# Altium schematic sheet D143.01A01-V9821S.SchDoc
size A2
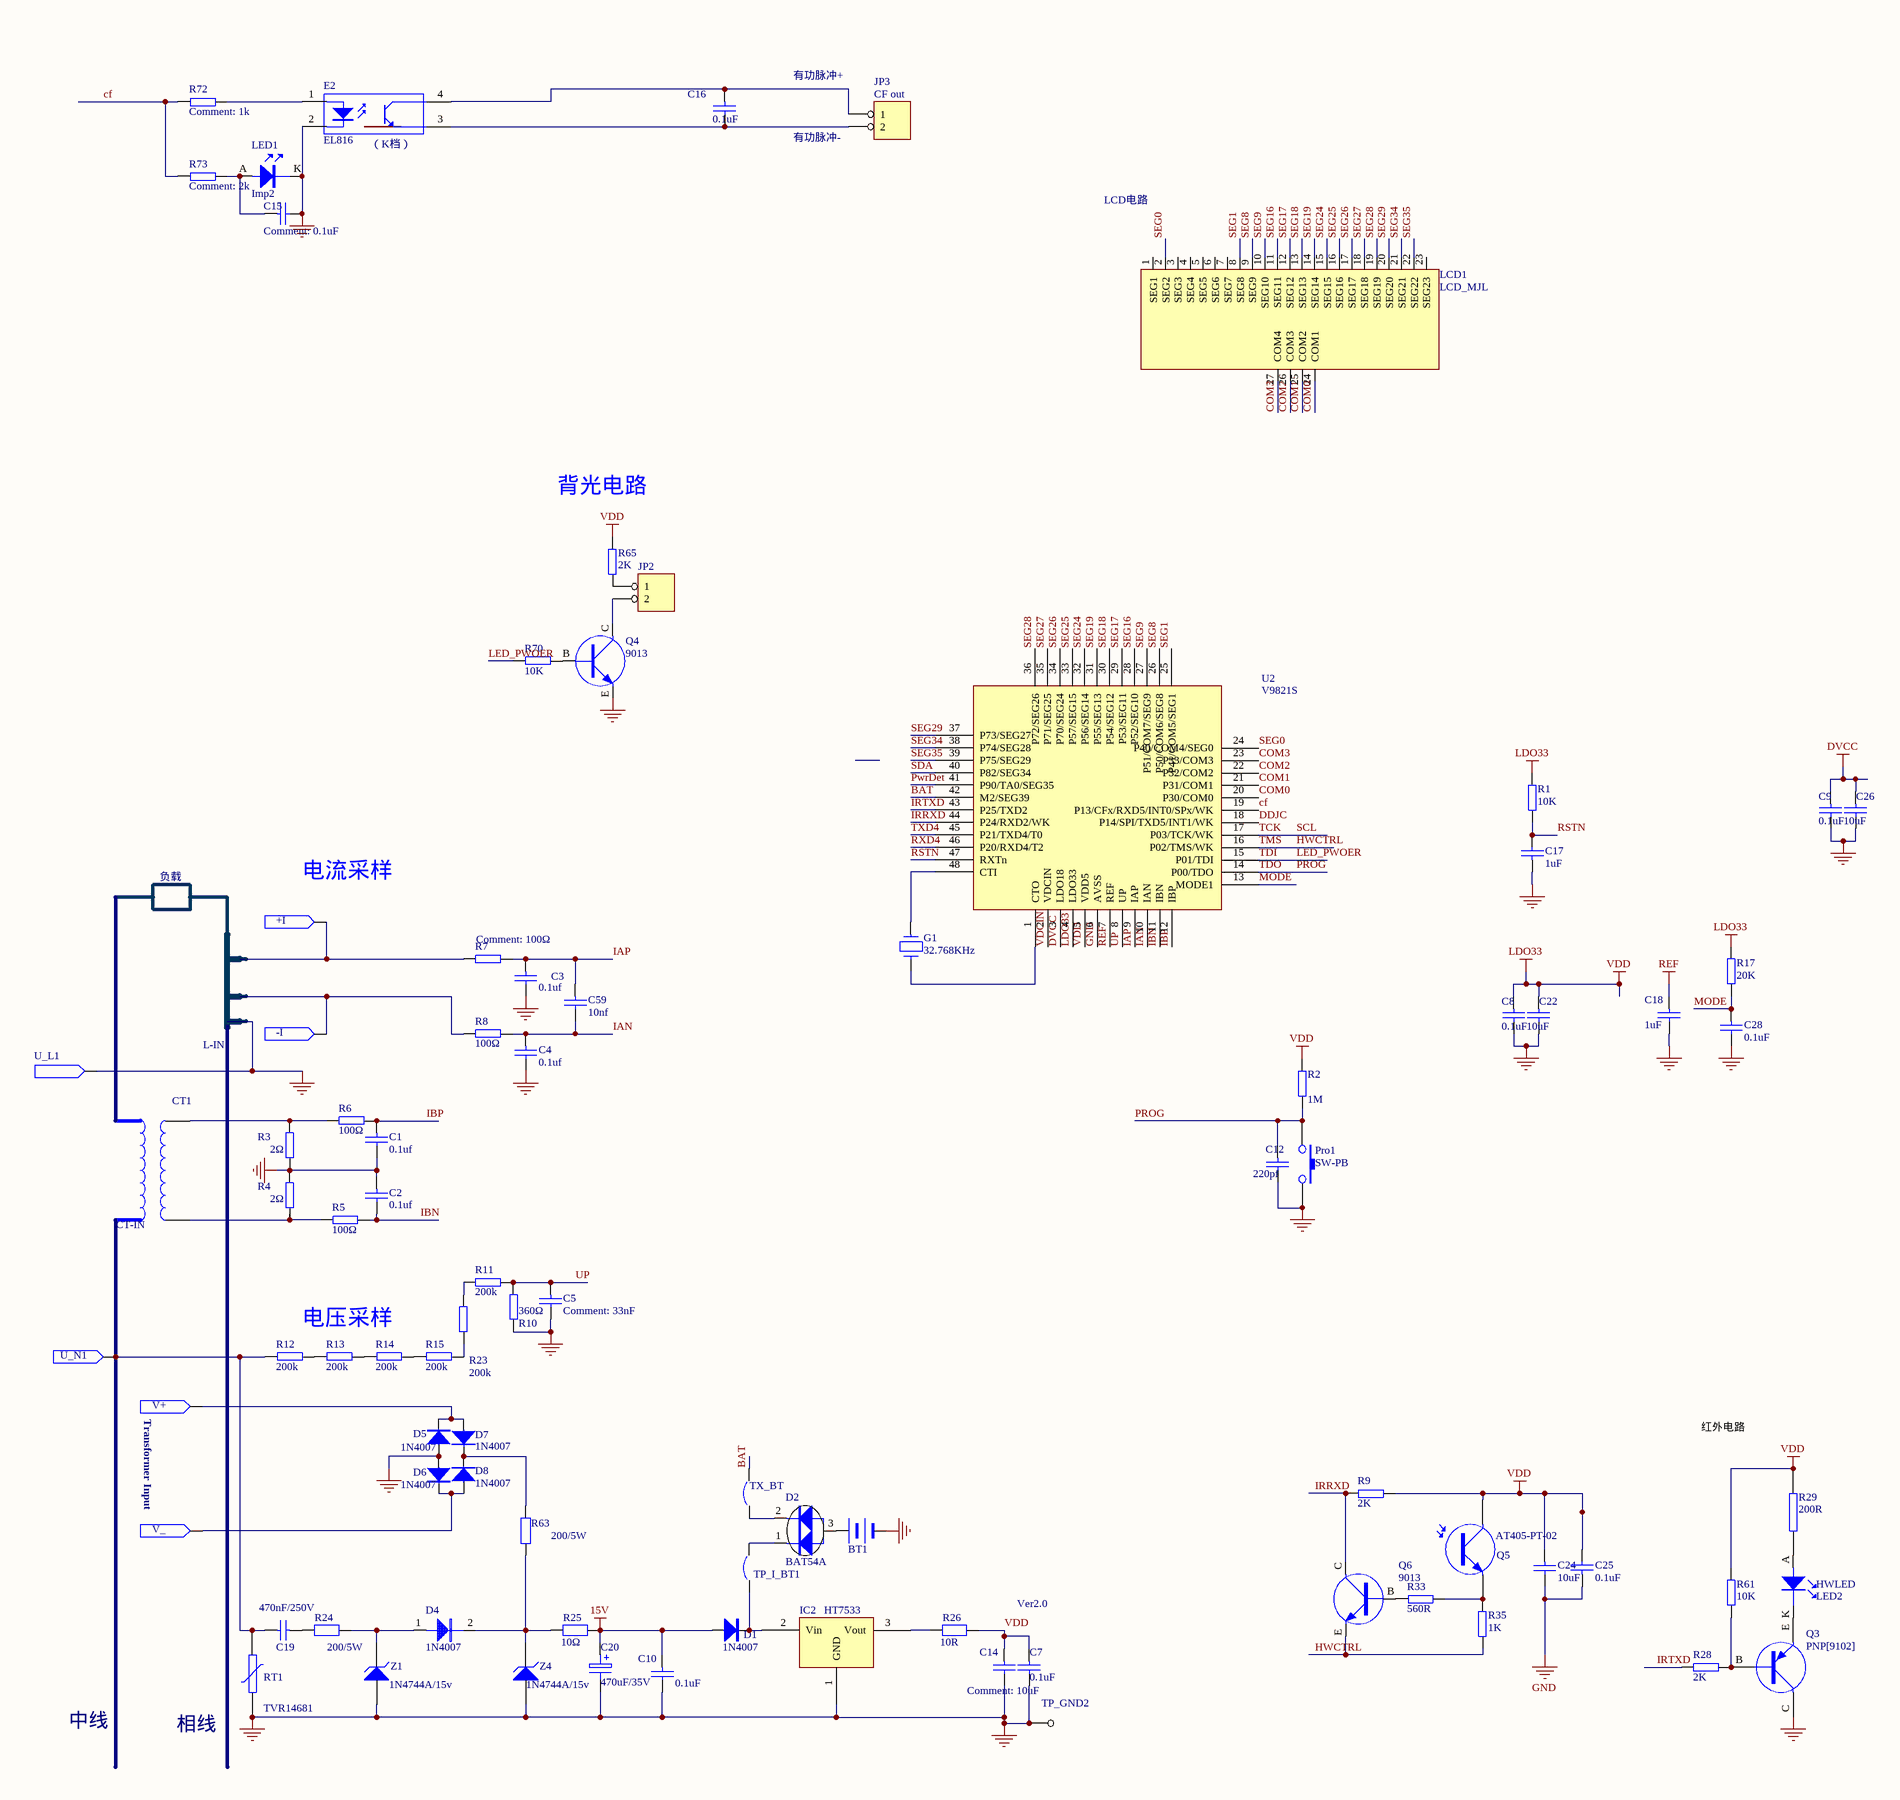
[diagram p0: D143.01A01-V9821S.SchDoc, left]
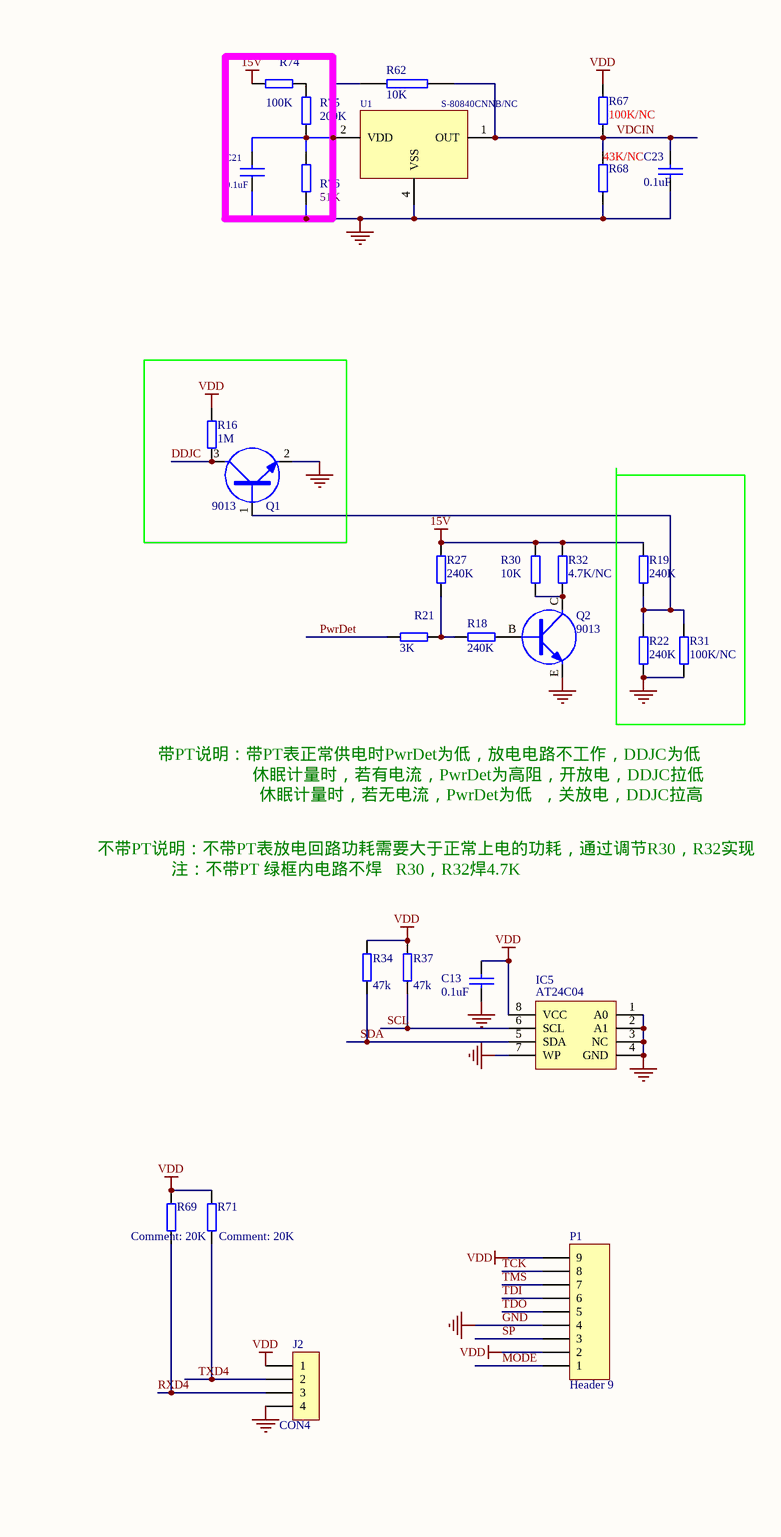
[diagram p1: D143.01A01-V9821S.SchDoc, right]

## Parts
+I  (no value)  [PAD]
-I  (no value)  [PAD]
BT1  BT1  [BAT]  (value not drawn)
C1  0.1uf  [0603C]
C2  0.1uf  [0603C]
C3  0.1uf  [0603C]
C4  0.1uf  [0603C]
C5  33nF  [0603C]
C7  0.1uF  [0603C]
C8  0.1uF  [0603C]
C9  0.1uF  [0603C]
C10  0.1uF  [0603C]
C12  220pf  [0603C]
C13  0.1uF  [0603C]
C14  10uF  [0805C]
C15  0.1uF  [0603C]
C16  0.1uF  [0603C]
C17  1uF  [0603C]
C18  1uF  [0805C]
C19  470nF/250V  [CAP0.47UF/250V]
C20  470uF/35V  [RB.2/.4]
C21  0.1uF  [0603C]
C22  10uF  [0805C]
C23  0.1uF  [0603C]
C24  10uF  [0805c]
C25  0.1uF  [0603C]
C26  10uF  [0805C]
C28  0.1uF  [0603C]
C59  10nf  [0603C]
CT1  CT-IN  [CT]
D1  1N4007  [MLL41]
D2  BAT54A  [SOT_23]
D4  1N4007  [DIODE-L]
D5  1N4007  [MLL41]
D6  1N4007  [MLL41]
D7  1N4007  [MLL41]
D8  1N4007  [MLL41]
E2  EL816  [SOP-4]
G1  32.768KHz  [OSC]
IC2  HT7533  [SOT-89]
IC5  AT24C04  [SOP8]
J2  CON4  [SIP4]
JP2  (no value)  [SIP2]
JP3  CF out  [ct]
LCD1  LCD_MJL  [LCD_MJL]
LED1  Imp2  [LED]
LED2  HWLED  [LED]
P1  Header 9  [CONNECT1]
Pro1  SW-PB  [KEY1]
Q1  9013  [SOT-23]
Q2  9013  [SOT-23-EBC]
Q3  PNP[9102]  [SOT-23-EBC]
Q4  9013  [SOT-23-EBC]
Q5  AT405-PT-02  [LED2]
Q6  9013  [SOT-23-EBC]
R1  10K  [0603R]
R2  1M  [0603R]
R3  2Ω  [0805R]
R4  2Ω  [0805R]
R5  100Ω  [0603R]
R6  100Ω  [0603R]
R7  100Ω  [0603R]
R8  100Ω  [0603R]
R9  2K  [0603R]
R10  360Ω  [0805R]
R11  200k  [0805R]
R12  200k  [0805R]
R13  200k  [0805R]
R14  200k  [0805R]
R15  200k  [0805R]
R16  1M  [0603R]
R17  20K  [0603R]
R18  240K  [0603R]
R19  240K  [0603R]
R21  3K  [0603R]
R22  240K  [0603R]
R23  200k  [0805R]
R24  200/5W  [AXIAL0.8A]
R25  10Ω  [0805R]
R26  10R  [0805R]
R27  240K  [0603R]
R28  2K  [0603R]
R29  200R  [0603R]
R30  10K  [0603R]
R31  100K/NC  [0603R]
R32  4.7K/NC  [0603R]
R33  560R  [0603R]
R34  47k  [0603R]
R35  1K  [0603R]
R37  47k  [0603R]
R61  10K  [0603R]
R62  10K  [0603R]
R63  200/5W  [AXIAL0.8A]
R65  2K  [0603R]
R67  100K/NC  [0603R]
R68  43K/NC  [0603R]
R69  20K  [0603R]
R70  10K  [0603R]
R71  20K  [0603R]
R72  1k  [0603R]
R73  2k  [0603R]
R74  100K  [0805R]
R75  200K  [0805R]
R76  51K  [0805R]
RT1  TVR14681  [YM20K681]
TP_GND2  TP  [TEST0]  (value not drawn)
TP_I_BT1  CIRCUIT BREAKER  [JUMP]  (value not drawn)
TX_BT  CIRCUIT BREAKER  [JUMP]  (value not drawn)
U1  S-80840CNNB/NC  [SC-82AB]
U2  V9821S
U_L1  (no value)  [PAD]
U_N1  (no value)  [PAD]
V+  (no value)  [PAD]
V_  (no value)  [PAD]
Z1  1N4744A/15v  [DIODE]
Z4  1N4744A/15v  [DIODE]

## Nets
15V: C10.1 C20.1 D1.1(A) R19.1 R25.1 R27.1 R30.2 R32.2 R74.2
DVCC: C9.1 C26.1 U2.3(LDO18)
GND: BT1.2(-) C1.2 C2.1 C3.2 C4.2 C5.2 C7.2 C8.2 C9.2 C10.2 C12.2 C13.2 C14.2 C15.2 C17.1 C18.2 C20.2 C21.1 C22.2 C23.2 C24.2 C25.1 C26.2 C28.2 D5.1(A) D6.1(A) E2.2 IC2.1(GND) IC5.1(A0) IC5.2(A1) IC5.3(NC) IC5.4(GND) IC5.7(WP) J2.4 LED1.K P1.4 Pro1.2 Pro1.4 Q1.2(E) Q2.E Q3.C Q4.E R3.2 R4.1 R10.2 R22.2 R31.1 R68.1 R76.1 RT1.2 TP_GND2.0 U1.4(VSS) U2.6(AVSS) U_L1.1 Z1.1(A) Z4.1(A)
LDO33: C7.1 C8.1 C13.1 C14.1 C22.1 C24.1 C25.2 IC5.8(VCC) J2.1 P1.2 P1.9 Q5.A(C) R1.2 R2.2 R9.2 R16.2 R17.1 R26.1 R29.2 R34.2 R37.2 R61.1 R65.2 R67.2 R69.1 R71.1 U2.4(LDO33) U2.5(VDD5)  [also labelled VDD]
NC: U1.3(NC)
REF: C18.1 U2.7(REF)
BAT: TX_BT.2 U2.42(M2/SEG39)
cf: R72.1 R73.1 U2.19(P13/CFx/RXD5/INT0/SPx/WK)
COM0: LCD1.24(COM1) U2.20(P30/COM0)
COM1: LCD1.25(COM2) U2.21(P31/COM1)
COM2: LCD1.26(COM3) U2.22(P32/COM2)
COM3: LCD1.27(COM4) U2.23(P33/COM3)
DDJC: Q1.3(C) R16.1 U2.18(P14/SPI/TXD5/INT1/WK)
HWCTRL: P1.7 Q6.E R35.1 U2.16(P02/TMS/WK)  [also labelled TMS]
IAN: C4.1 C59.2 R8.1 U2.10(IAN)
IAP: C3.1 C59.1 R7.1 U2.9(IAP)
IBN: C2.2 R5.1 U2.11(IBN)
IBP: C1.1 R6.1 U2.12(IBP)
IRRXD: Q6.C R9.1 U2.44(P24/RXD2/WK)
IRTXD: R28.2 U2.43(P25/TXD2)
LED_PWOER: P1.6 R70.2 U2.15(P01/TDI)  [also labelled TDI]
MODE: C28.1 P1.1 R17.2 U2.13(MODE1)
PROG: C12.1 P1.5 Pro1.1 Pro1.3 R2.1 U2.14(P00/TDO)  [also labelled TDO]
PwrDet: R21.1 U2.41(P90/TA0/SEG35)
RSTN: C17.2 R1.1 U2.47(RXTn)
RXD4: J2.3 R69.2 U2.46(P20/RXD4/T2)
SCL: IC5.6(SCL) P1.8 R37.1 U2.17(P03/TCK/WK)  [also labelled TCK]
SDA: IC5.5(SDA) R34.1 U2.40(P82/SEG34)
SEG0: LCD1.2(SEG2) U2.24(P40/COM4/SEG0)
SEG1: LCD1.8(SEG8) U2.25(P41/COM5/SEG1)
SEG8: LCD1.9(SEG9) U2.26(P50/COM6/SEG8)
SEG9: LCD1.10(SEG10) U2.27(P51/COM7/SEG9)
SEG16: LCD1.11(SEG11) U2.28(P52/SEG10)
SEG17: LCD1.12(SEG12) U2.29(P53/SEG11)
SEG18: LCD1.13(SEG13) U2.30(P54/SEG12)
SEG19: LCD1.14(SEG14) U2.31(P55/SEG13)
SEG24: LCD1.15(SEG15) U2.32(P56/SEG14)
SEG25: LCD1.16(SEG16) U2.33(P57/SEG15)
SEG26: LCD1.17(SEG17) U2.34(P70/SEG24)
SEG27: LCD1.18(SEG18) U2.35(P71/SEG25)
SEG28: LCD1.19(SEG19) U2.36(P72/SEG26)
SEG29: LCD1.20(SEG20) U2.37(P73/SEG27)
SEG34: LCD1.21(SEG21) U2.38(P74/SEG28)
SEG35: LCD1.22(SEG22) U2.39(P75/SEG29)
SP: P1.3
TXD4: J2.2 R71.2 U2.45(P21/TXD4/T0)
UP: C5.1 R10.1 R11.2 U2.8(UP)
VDCIN: C23.1 R62.1 R67.1 R68.2 U1.1(OUT) U2.2(VDCIN)
Net+I_1: +I.1 R7.2
Net-I_1: -I.1 R8.2
NetBT1_1: BT1.1(+) D2.3
NetC15_1: C15.1 LED1.A R73.2
NetC16_1: C16.1 E2.4 JP3.1
NetC16_2: C16.2 E2.3 JP3.2
NetC19_1: C19.1 R24.2
NetC19_2: C19.2 R12.2 RT1.1 U_N1.1
NetC21_2: C21.2 R62.2 R75.2 R76.2 U1.2(VDD)
NetCT1_1: CT1.1 R4.2 R5.2
NetCT1_2: CT1.2 R3.1 R6.2
NetD1_2: D1.2(K) IC2.2(Vin) TP_I_BT1.1
NetD2_1: D2.1 TP_I_BT1.2
NetD2_2: D2.2 TX_BT.1
NetD4_1: D4.1 R24.1 Z1.2(K)
NetD4_2: D4.2 R25.2 R63.2 Z4.2(K)
NetD5_2: D5.2(K) D7.1(A) V+.1
NetD6_2: D6.2(K) D8.1(A) V_.1
NetD7_2: D7.2(K) D8.2(K) R63.1
NetE2_1: E2.1 R72.2
NetG1_1: G1.1 U2.48(CTI)
NetG1_2: G1.2 U2.1(CTO)
NetIC2_3: IC2.3(Vout) R26.2
NetJP2_1: JP2.1 R65.1
NetJP2_2: JP2.2 Q4.C
NetLED2_A: LED2.A R29.1
NetLED2_K: LED2.K Q3.E
NetQ1_1: Q1.1(B) R19.2 R22.1 R31.2
NetQ2_B: Q2.B R18.2
NetQ2_C: Q2.C R30.1 R32.1
NetQ3_B: Q3.B R28.1 R61.2
NetQ4_B: Q4.B R70.1
NetQ5_K: Q5.K(E) R33.2 R35.2
NetQ6_B: Q6.B R33.1
NetR11_1: R11.1 R23.2
NetR12_1: R12.1 R13.2
NetR13_1: R13.1 R14.2
NetR14_1: R14.1 R15.2
NetR15_1: R15.1 R23.1
NetR18_1: R18.1 R21.2 R27.2
NetR74_1: R74.1 R75.1

Not connected (* = marked no-connect by the designer): LCD1 1(SEG1) 3(SEG3) 4(SEG4) 5(SEG5) 6(SEG6) 7(SEG7) 23(SEG23)

## Notes on the sheet
- 有功脉冲+
- (near E2) （K档）
- 有功脉冲-
- LCD电路
- 背光电路
- 带PT说明：带PT表正常供电时PwrDet为低，放电电路不工作，DDJC为低
- 休眠计量时，若有电流，PwrDet为高阻，开放电，DDJC拉低
- 休眠计量时，若无电流，PwrDet为低  ，关放电，DDJC拉高
- 不带PT说明：不带PT表放电回路功耗需要大于正常上电的功耗，通过调节R30，R32实现
- 注：不带PT 绿框内电路不焊   R30，R32焊4.7K
- 负载
- (near +I) 电流采样
- L-IN
- 电压采样
- Transformer Input
- (near R29) 红外电路
- Ver2.0
- 中线
- 相线

## Library data of the parts
+I -I U_L1 U_N1 V+ V_ = Pro2C.tmp_UnNamed_44
BT1 = BATTERY
C1-C5 C7-C10 C12-C18 C22-C24 C26 C28 C59 = CAP: Capacitor
C19 = Cap Semi: Capacitor (Semiconductor SIM Model); Published: *; Publisher: *; Manufacturer: *; Class: *; SubClass: *; Value: *
C20 = ProB204.TMP_UnNamed_47
C21 = CAP NP: Text Field1: 20; Text Field2: 10
C25 = CAP
CT1 = WZ-CT-S
D1 D5-D8 = WF_D
D2 = BAT54A: 共阳
D4 = ProB204.TMP_UnNamed_35
E2 = TL521
G1 = WF_X_1: Crystal
IC2 = HT7150
IC5 = AT24256
J2 = CON4: Connector
JP2 JP3 = HEADER 2
LED1 LED2 = LED
P1 = Header 9: Header, 9-Pin; LatestRevisionDate: 17-Jul-2002; LatestRevisionNote: Re-released for DXP Platform.; Publisher: Altium Limited
Q1 Q2 Q4 Q6 = NPN
Q5 = 3244SC
R1-R8 R10-R19 R21-R23 R27 R30-R32 R34 R37 R67-R69 R71-R76 = REST_S
R9 R28 R33 R35 R61 R65 R70 = R
R24-R26 R63 = Res2: Resistor; Published: *; Publisher: *; Manufacturer: *; Class: *; SubClass: *; Value: *
R29 R62 = RES2
RT1 = WF_RESV
TP_GND2 = TP_T: TEST POINT
U1 = S808XX_CLNB: 电源检测IC
U2 = Component_1
Z1 Z4 = 1N4734A: One Watt Zener; Value: *; Type: *